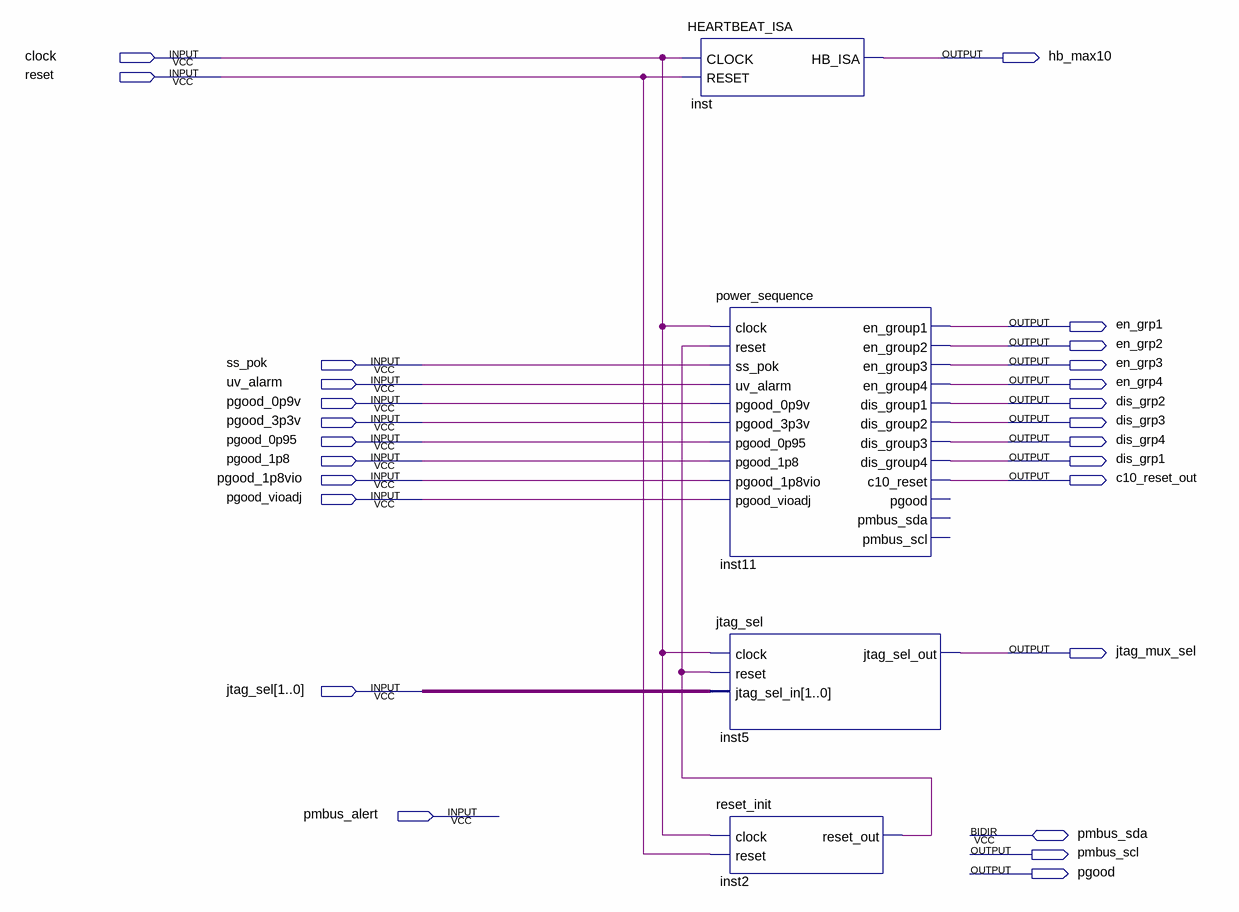
[diagram p0: schematic sheet]
// Quartus schematic llrf3p0_power_sequence.bdf as structural Verilog: 4 symbols, 26 pins
module llrf3p0_power_sequence (
  input  clock,
  input  reset,
  input  ss_pok,
  input  uv_alarm,
  input  pgood_0p9v,
  input  pgood_3p3v,
  input  pgood_0p95,
  input  pgood_1p8,
  input  pgood_1p8vio,
  input  pgood_vioadj,
  input  [1:0] jtag_sel,
  input  pmbus_alert,
  inout  pmbus_sda,
  output hb_max10,
  output en_grp1,
  output en_grp2,
  output en_grp3,
  output en_grp4,
  output dis_grp2,
  output dis_grp3,
  output dis_grp4,
  output dis_grp1,
  output c10_reset_out,
  output jtag_mux_sel,
  output pmbus_scl,
  output pgood
);

  wire inst2_reset_out;

  HEARTBEAT_ISA inst (.CLOCK(clock), .RESET(reset), .HB_ISA(hb_max10));
  power_sequence inst11 (
    .clock(clock), .reset(inst2_reset_out), .ss_pok(ss_pok), .uv_alarm(uv_alarm), .pgood_0p9v(pgood_0p9v),
    .pgood_3p3v(pgood_3p3v), .pgood_0p95(pgood_0p95), .pgood_1p8(pgood_1p8), .pgood_1p8vio(pgood_1p8vio),
    .pgood_vioadj(pgood_vioadj), .en_group1(en_grp1), .en_group2(en_grp2), .en_group3(en_grp3),
    .en_group4(en_grp4), .dis_group1(dis_grp2), .dis_group2(dis_grp3), .dis_group3(dis_grp4),
    .dis_group4(dis_grp1), .c10_reset(c10_reset_out));  // open: pgood, pmbus_scl, pmbus_sda
  jtag_sel inst5 (.clock(clock), .reset(inst2_reset_out), .jtag_sel_in(jtag_sel), .jtag_sel_out(jtag_mux_sel));
  reset_init inst2 (.clock(clock), .reset(reset), .reset_out(inst2_reset_out));
endmodule
